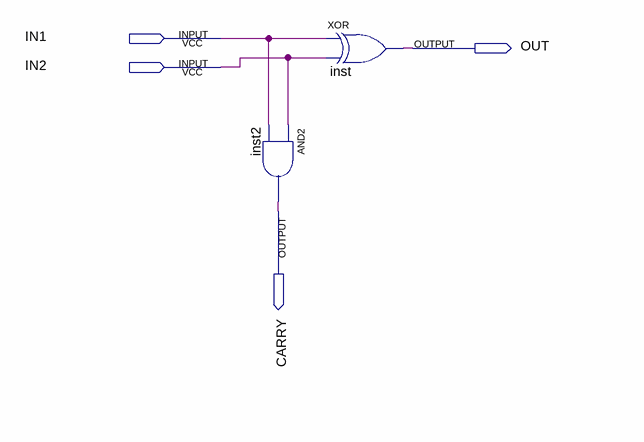
[diagram p0: schematic sheet]
// Quartus schematic sdProjectMeioSomador.bdf as structural Verilog: 2 symbols, 4 pins
module sdProjectMeioSomador (
  input  IN1,
  input  IN2,
  output OUT,
  output CARRY
);

  and inst2 (CARRY, IN2, IN1);
  xor inst (OUT, IN1, IN2);
endmodule
